# EAGLE design ps (EAGLE 7.5.0)
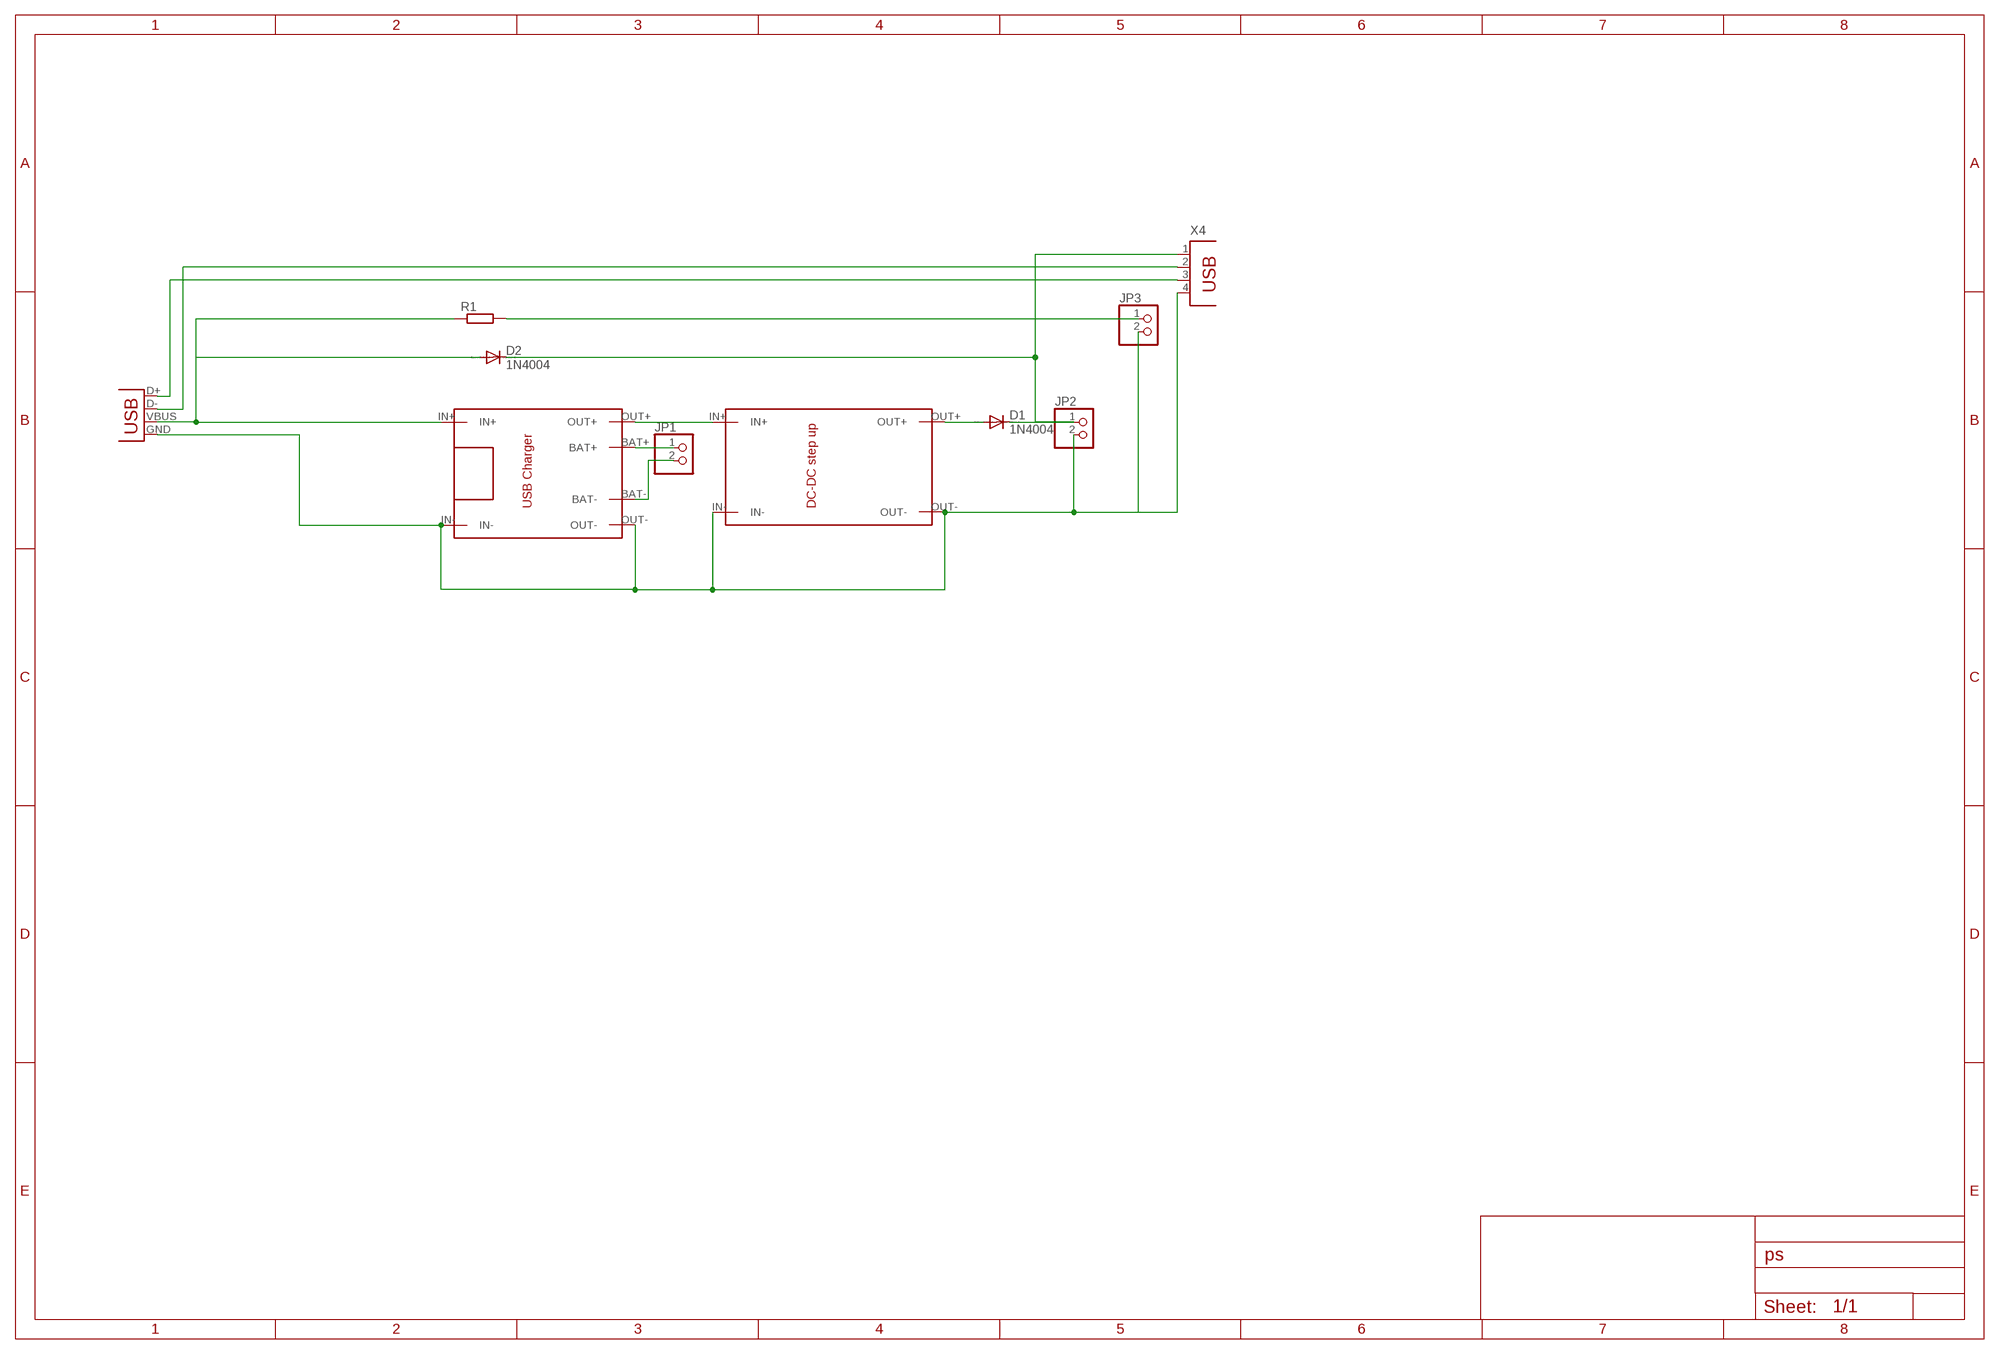
[diagram p0: schematic, sheet 1]

## Parts
D1  1N4004  [DO41-10]
D2  1N4004  [DO41-10]
JP1  PINHD-1X2  [1X02]
JP2  PINHD-1X2  [1X02]
JP3  PINHD-1X2  [1X02]
R1  R-EU_0204/7  [0204/7]
U$1  TP4056  [TP4056]
U$2  DC-DC_STEPUP  [DC-DC_STEPUP]
X3  USBPTH  [USB-B-PTH]
X4  PN87520  [PN87520]

## Nets
N$1: D2.A R1.1 U$1.IN+ X3.VBUS
N$2: U$1.OUT+ U$2.IN+
N$6: JP1.1 U$1.BAT+
N$7: JP1.2 U$1.BAT-
N$8: D1.A U$2.OUT+
N$9: D1.C D2.C JP2.1 X4.1
N$10: JP2.2 JP3.2 U$1.IN- U$1.OUT- U$2.IN- U$2.OUT- X3.GND X4.4
N$12: JP3.1 R1.2
N$13: X3.D+ X4.3
N$14: X3.D- X4.2

## Library data of the parts
D1 D2 = diode:1N4004: DIODE general purpose rectifier, 1 A
JP1-JP3 = pinhead:PINHD-1X2: PIN HEADER
R1 = resistor:R-EU_: RESISTOR, European symbol
U$1 = TP4056 charging module with protection:TP4056
U$2 = DC-DC step up:DC-DC_STEPUP
X3 = usb:USB: USB Connectors USB-B-PTH is fully proven SKU : PRT-00139 USB-miniB is fully proven SKU : PRT-00587 USB-A-PCB is untested. USB-A-H is throughly reviewed, but untested. Spark Fun Electronics SKU : PRT-00437 USB-B-SMT is throughly reviewed, but untested. Needs silkscreen touching up. USB-A-S has not been used/tested USB-MB-H has not been used/tested
X4 = con-berg:PN87520: BERG USB connector; OC_FARNELL: unknown; OC_NEWARK: unknown

## Board
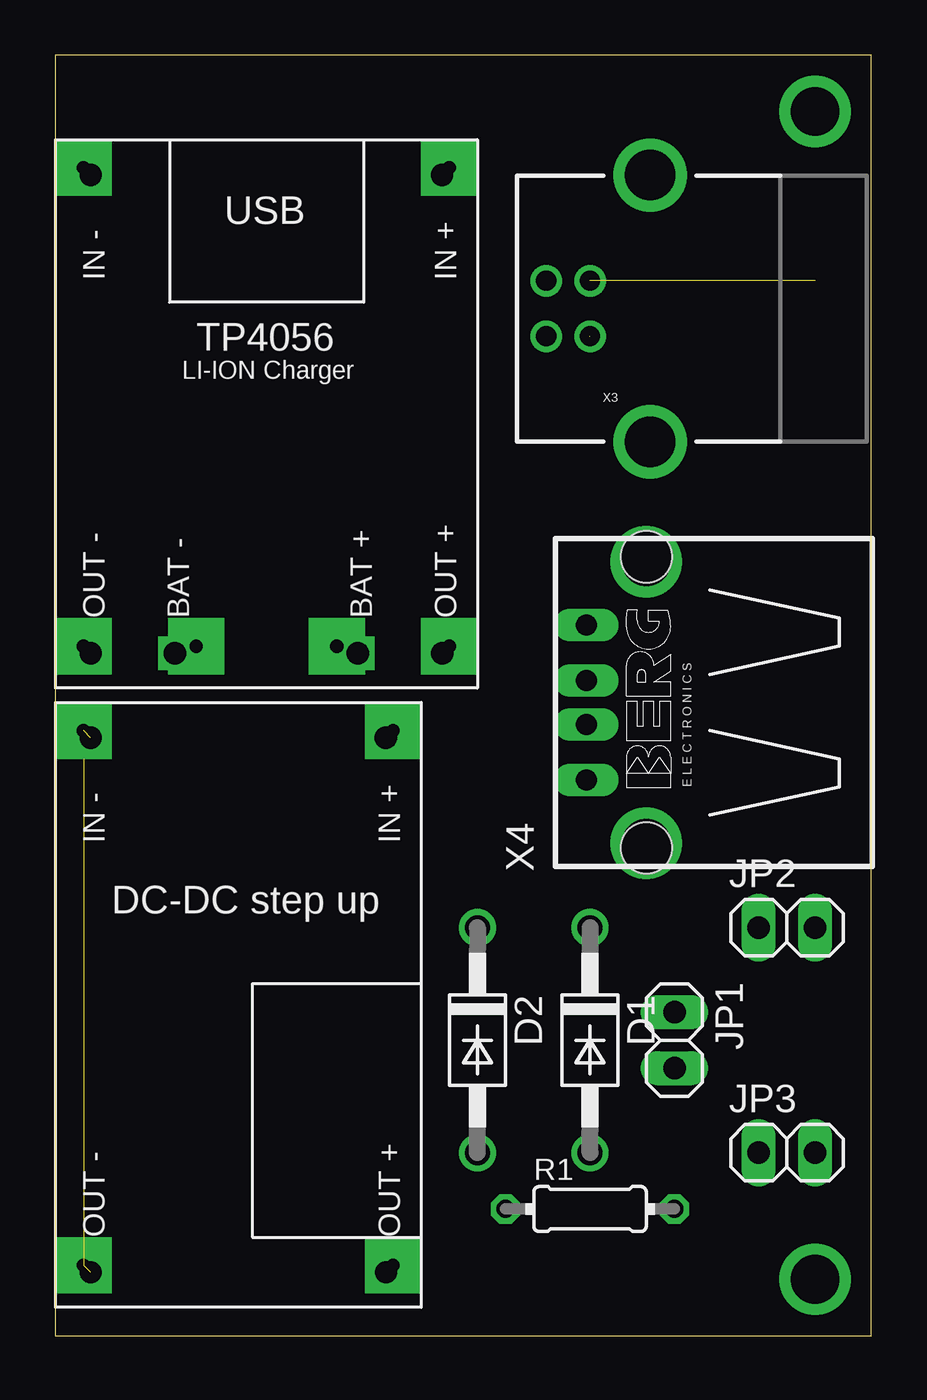
[diagram p1: board, top side]
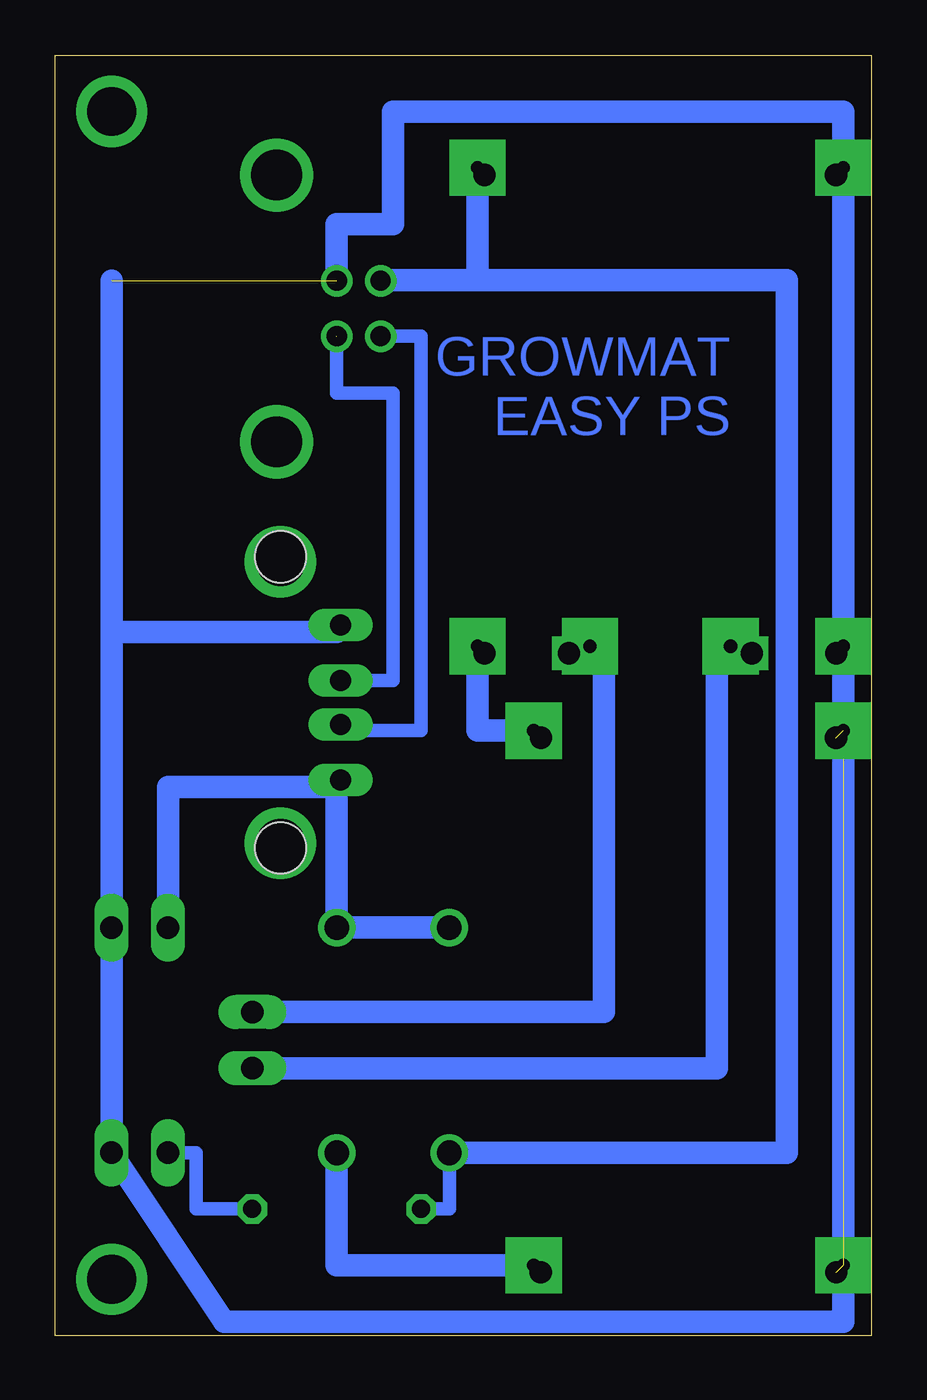
[diagram p2: board, bottom side, seen from below]

Size 36.83 x 57.77 mm. Coordinates in mm from the lower left corner, seen from the top.
Outline: 0,0 36.83,0 36.83,57.77 0,57.77 0,0
Copper layers (1*16): Top 0.035mm / dielectric 1.5mm / Bottom 0.035mm
Design rules "default": minimum track width 10mil, minimum drill 24mil, track to track 8mil, track to pad 8mil, pad to pad 8mil, via to via 8mil, smd to smd 8mil, copper to edge 40mil, drill to drill 8mil, minimum pad ring 10mil, minimum via ring 8mil, stop-mask expansion 4mil, vias tented up to drill 0mil, thermal gap 10mil

### Footprints (pad centres in the part's own frame; a part is rotated, then mirrored left to right if it is on the bottom)
DO41-10 = drill 1.118: A 5.08,0; C -5.08,0
1X02 = drill 1.016 long: 1 -1.27,0; 2 1.27,0
0204/7 = drill 0.813 octagon: 1 -3.81,0; 2 3.81,0
TP4056 = drill 1 pad 1.422 square: BAT+ 4.763,-10.477; BAT- -3.493,-10.477; IN+ 8.565,11.105; IN- -7.295,11.105; OUT+ 8.572,-10.477; OUT- -7.303,-10.477
DC-DC_STEPUP = drill 1 pad 1.422 square: IN+ 6.025,11.105; IN- -7.295,11.105; OUT+ 6.032,-13.018; OUT- -7.303,-13.018
USB-B-PTH = drill 0.914: D+ 0,1.25; D- 1.981,1.25; GND 0,-1.25; VBUS 1.981,-1.25 | drill 2.286: P$1 -2.718,-6.02; P$2 -2.718,6.02
PN87520 = drill 0.95 long: 1 -3.5,2.71; 2 -1,2.71; 3 1,2.71; 4 3.5,2.71 | hole 2.3: -6.57,0; 6.57,0

### Placement (x,y rotation side)
D1  24.13,13.33 270 top
D2  19.05,13.33 270 top
JP1  27.94,13.33 270 top
JP2  33.02,18.42 0 top
JP3  33.02,8.26 0 top
R1  24.13,5.71 0 top
U$1  8.89,41.27 0 top
U$2  8.89,15.88 0 top
X3  24.13,46.35 180 top
X4  26.67,28.58 90 top

### Tracks (layer width: path | path; a pad name or v marks a point on that pad's centre or on a via)
N$1
  Bottom 0.254: 21.59,47.62 X3.VBUS | 17.78,47.62 U$1.IN+
  Bottom 0.61: D2.A 19.05,5.71 R1.1
  Bottom 1.016: 17.78,47.62 3.81,47.62 3.81,8.26 D2.A | 17.78,52.07 17.78,47.62 | 17.78,47.62 21.59,47.62
N$2
  Bottom 0.254: 15.24,27.31 U$2.IN+ | 17.78,30.48 U$1.OUT+
  Bottom 1.016: 15.24,27.31 17.78,27.31 17.78,30.48
N$4  (via drill 0.6 pad 2.54)  (1 unrouted)
  Bottom 1.016: v1.27,27.31 v1.27,3.17
  other vias: 15.24,3.17 1.27,31.12 6.35,31.12 17.78,31.12 12.7,31.12 15.24,27.31 17.78,52.7 1.27,52.7
N$5  (via drill 2.2)
  other vias: 34.29,55.24 34.29,2.54 26.67,34.92 26.67,22.23
N$6
  Bottom 0.254: 12.07,30.48 U$1.BAT+
  Bottom 1.016: 12.07,30.48 12.07,14.61 JP1.1
N$7
  Bottom 0.254: 6.98,30.48 U$1.BAT-
  Bottom 1.016: 6.98,30.48 6.98,12.06 JP1.2
N$8
  Bottom 0.254: 15.24,3.17 U$2.OUT+
  Bottom 1.016: 15.24,3.17 24.13,3.17 D1.A
N$9
  Bottom 1.016: D2.C D1.C 24.13,25.08 X4.1 23.96,24.77 31.75,24.77 JP2.1
N$10  (3 unrouted)
  Bottom 0.254: 1.27,31.12 U$1.OUT- | 1.27,52.7 U$1.IN- | 1.27,26.67 U$2.IN- | 24.13,31.75 X4.4
  Bottom 1.016: U$1.OUT- 1.27,30.8 1.27,27.31 | 1.27,31.12 1.27,52.7 1.27,55.24 21.59,55.24 21.59,50.16 24.13,50.16 X3.GND | 34.29,31.75 24.13,31.75 | 34.29,47.6 34.29,31.75 | 1.27,3.17 1.27,0.64 29.21,0.64 JP3.2 JP2.2 34.29,31.75
  Bottom 1.27: 1.27,26.67 1.59,26.67
N$12
  Bottom 0.61: R1.2 30.48,5.71 30.48,8.26 JP3.1
N$13  (1 unrouted)
  Bottom 0.61: X4.3 21.59,29.58 21.59,42.54 24.13,42.54 24.13,45.09
N$14
  Bottom 0.61: X3.D- 20.32,45.1 20.32,27.31 23.96,27.31 X4.2

### Text on the board
Bottom: GROWMAT / EASY PS